# Altium project PCB_MainControlV20.PrjPCB
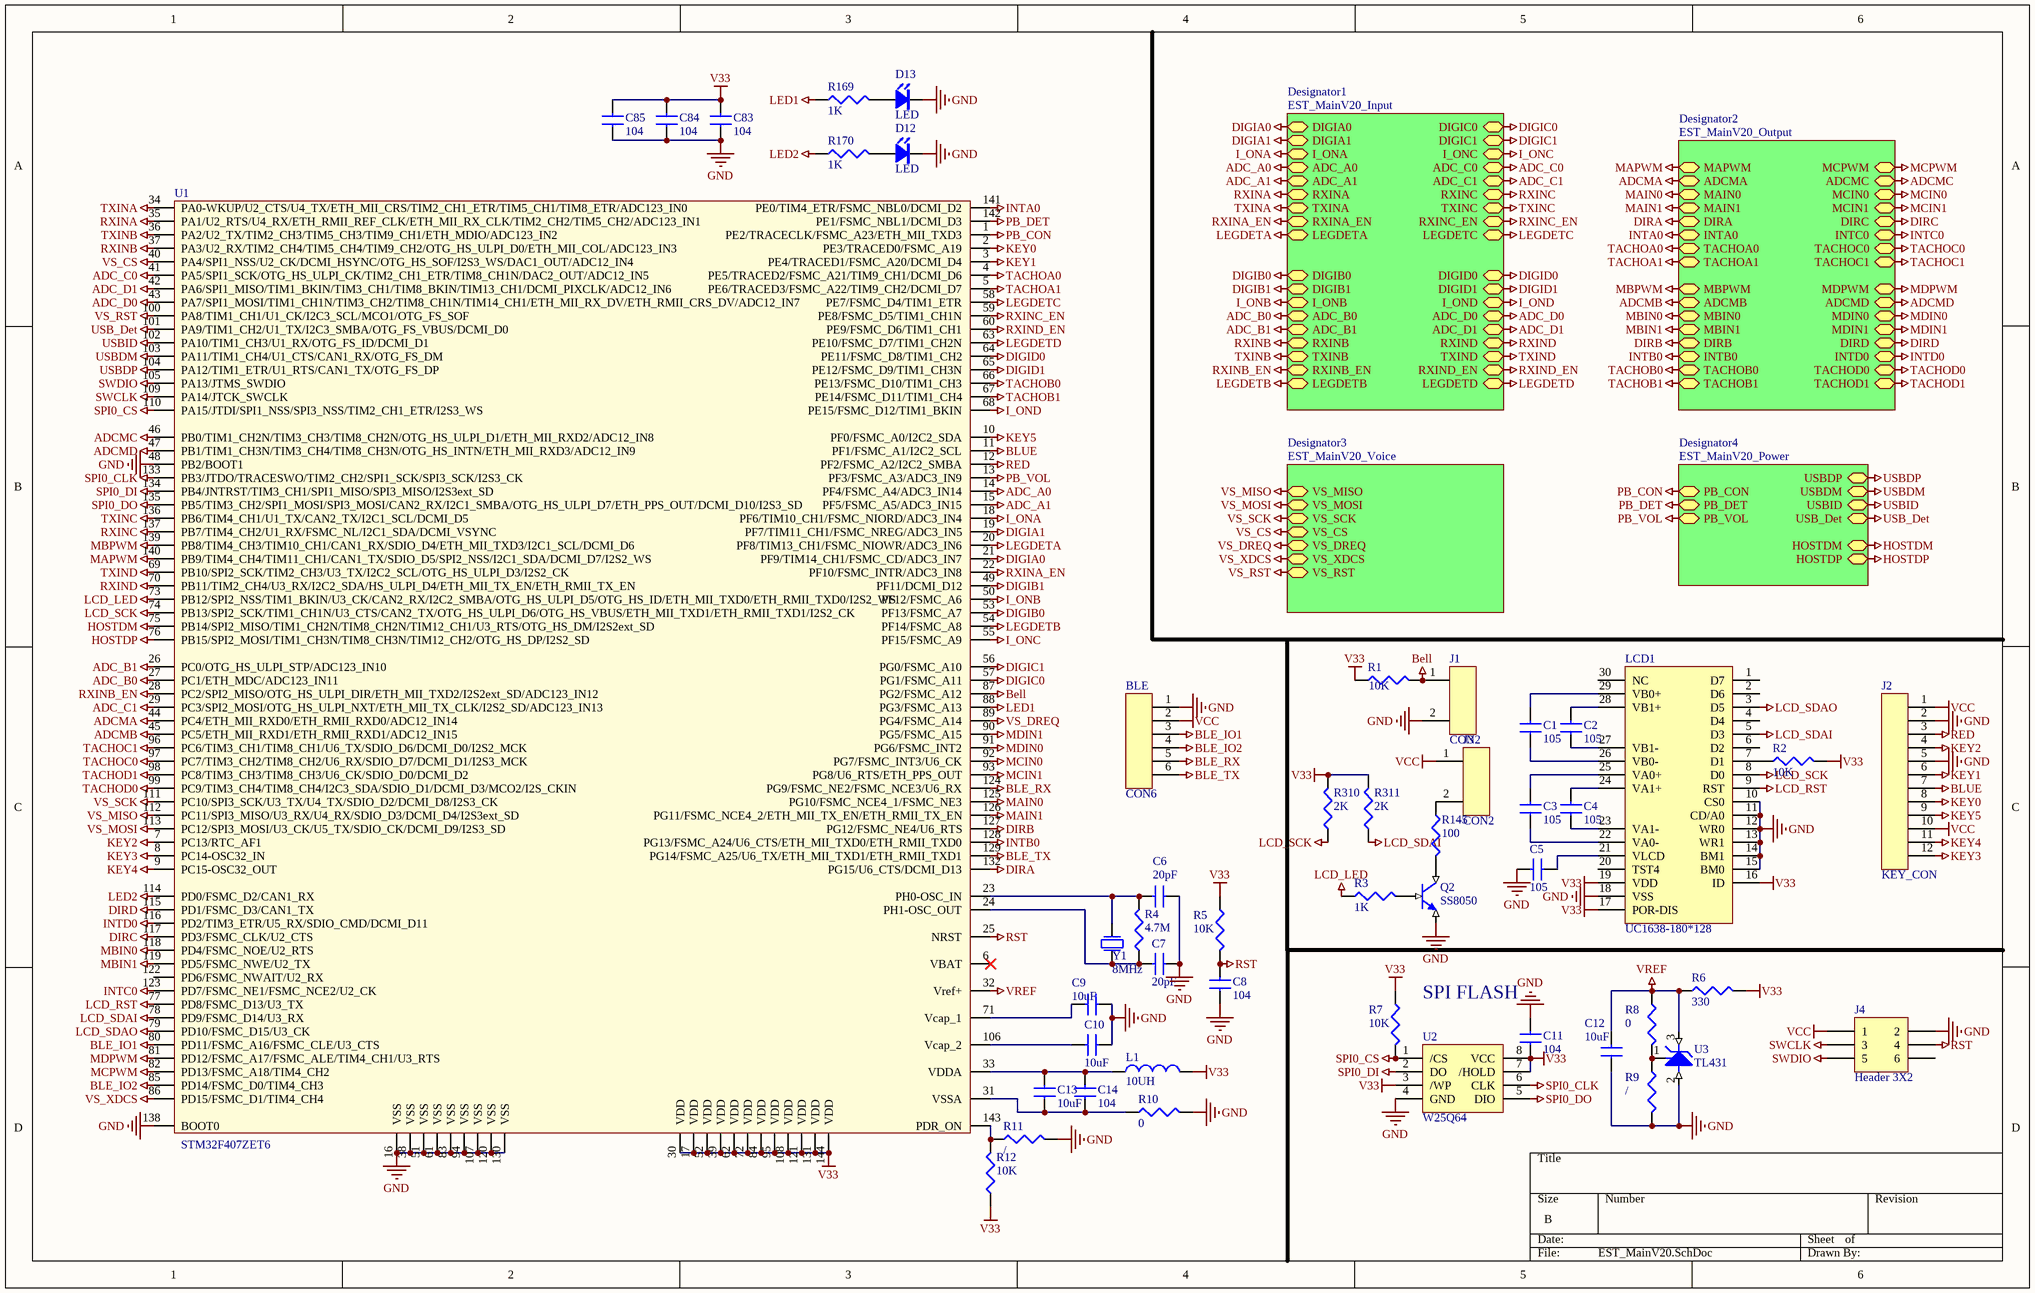
[diagram p0: EST_MainV20.SchDoc]
5 sheets, 330 parts. Net scope: hierarchical (ports join the sheet entries above them; power ports are global).
Board file: EST_MainV20.PcbDoc
Sheets:
  EST_MainV20.SchDoc
    Designator1 = EST_MainV20_Input.SchDoc
    Designator2 = EST_MainV20_Output.SchDoc
    Designator4 = EST_MainV20_Power.SchDoc
    Designator3 = EST_MainV20_Voice.SchDoc

## Sheet EST_MainV20.SchDoc
size B

### Parts
BLE  CON6  [H2_2.0mm_2*3]
C1  105  [CAP_0603]
C2  105  [CAP_0603]
C3  105  [CAP_0603]
C4  105  [CAP_0603]
C5  105  [CAP_0805]
C6  20pF  [CAP_0603]
C7  20pF  [CAP_0603]
C8  104  [CAP_0603]
C9  value 10uF  [CAP_0805]  (hidden comment: 20pF)
C10  value 10uF  [CAP_0805]  (hidden comment: 20pF)
C11  104  [CAP_0603]
C12  value 10uF  [CAP_0805]  (hidden comment: 20pF)
C13  value 10uF  [CAP_0805]  (hidden comment: 20pF)
C14  104  [CAP_0603]
C83  104  [CAP_0603]
C84  104  [CAP_0603]
C85  104  [CAP_0603]
D12  LED  [LED-0603]
D13  LED  [LED-0603]
J1  CON2  [EST_DZ_SW]
J2  KEY_CON  [FPC_12P]
J3  CON2  [SIP2]
J4  Header 3X2  [H2_2.0mm_2*3]
L1  10UH  [0805]
LCD1  UC1638-180*128  [FPC_30P]
Q2  SS8050  [8050SMD]
R1  10K  [RES_0603]
R2  10K  [RES_0603]
R3  1K  [RES_0603]
R4  4.7M  [RES_0603]
R5  10K  [RES_0603]
R6  330  [RES_0603]
R7  10K  [RES_0603]
R8  0  [RES_0603]
R9  /  [RES_0603]
R10  0  [RES_0603]
R11  /  [RES_0603]
R12  10K  [RES_0603]
R145  100  [1206]
R169  1K  [RES_0603]
R170  1K  [RES_0603]
R310  2K  [RES_0603]
R311  2K  [RES_0603]
U1  STM32F407ZET6  [LQFP144]
U2  W25Q64  [WSON8]
U3  TL431  [TL431(SOT23)]
Y1  8MHz  [XTAL_5032]

### Sub-sheets
Designator1 = EST_MainV20_Input: DIGIA0, DIGIA1, I_ONA, ADC_A0, ADC_A1, RXINA, TXINA, RXINA_EN, DIGIC0, DIGIC1, I_ONC, ADC_C0, ADC_C1, RXINC, TXINC, RXINC_EN, DIGIB0, DIGIB1, I_ONB, ADC_B0, ADC_B1, RXINB, TXINB, RXINB_EN, DIGID0, DIGID1, I_OND, ADC_D0, ADC_D1, RXIND, TXIND, RXIND_EN, LEGDETA, LEGDETC, LEGDETB, LEGDETD
Designator2 = EST_MainV20_Output: MAPWM, ADCMA, MAIN0, MAIN1, DIRA, INTA0, MBPWM, ADCMB, MBIN0, MBIN1, DIRB, INTB0, MCPWM, ADCMC, MCIN0, MCIN1, DIRC, INTC0, MDPWM, ADCMD, MDIN0, MDIN1, DIRD, INTD0, TACHOA0, TACHOA1, TACHOB0, TACHOB1, TACHOC0, TACHOC1, TACHOD0, TACHOD1
Designator3 = EST_MainV20_Voice: VS_MISO, VS_MOSI, VS_SCK, VS_CS, VS_DREQ, VS_XDCS, VS_RST
Designator4 = EST_MainV20_Power: PB_CON, PB_DET, PB_VOL, USBDP, USBDM, USBID, USB_Det, HOSTDM, HOSTDP

### Nets
ADC_A0: U1.14(PF4/FSMC_A4/ADC3_IN14) ; sheet Designator1/ADC_A0
ADC_A1: U1.15(PF5/FSMC_A5/ADC3_IN15) ; sheet Designator1/ADC_A1
ADC_B0: U1.27(PC1/ETH_MDC/ADC123_IN11) ; sheet Designator1/ADC_B0
ADC_B1: U1.26(PC0/OTG_HS_ULPI_STP/ADC123_IN10) ; sheet Designator1/ADC_B1
ADC_C0: U1.41(PA5/SPI1_SCK/OTG_HS_ULPI_CK/TIM2_CH1_ETR/TIM8_CH1N/DAC2_OUT/ADC12_IN5) ; sheet Designator1/ADC_C0
ADC_C1: U1.29(PC3/SPI2_MOSI/OTG_HS_ULPI_NXT/ETH_MII_TX_CLK/I2S2_SD/ADC123_IN13) ; sheet Designator1/ADC_C1
ADC_D0: U1.43(PA7/SPI1_MOSI/TIM1_CH1N/TIM3_CH2/TIM8_CH1N/TIM14_CH1/ETH_MII_RX_DV/ETH_RMII_CRS_DV/ADC12_IN7) ; sheet Designator1/ADC_D0
ADC_D1: U1.42(PA6/SPI1_MISO/TIM1_BKIN/TIM3_CH1/TIM8_BKIN/TIM13_CH1/DCMI_PIXCLK/ADC12_IN6) ; sheet Designator1/ADC_D1
ADCMA: U1.44(PC4/ETH_MII_RXD0/ETH_RMII_RXD0/ADC12_IN14) ; sheet Designator2/ADCMA
ADCMB: U1.45(PC5/ETH_MII_RXD1/ETH_RMII_RXD1/ADC12_IN15) ; sheet Designator2/ADCMB
ADCMC: U1.46(PB0/TIM1_CH2N/TIM3_CH3/TIM8_CH2N/OTG_HS_ULPI_D1/ETH_MII_RXD2/ADC12_IN8) ; sheet Designator2/ADCMC
ADCMD: U1.47(PB1/TIM1_CH3N/TIM3_CH4/TIM8_CH3N/OTG_HS_INTN/ETH_MII_RXD3/ADC12_IN9) ; sheet Designator2/ADCMD
Bell: J1.1 R1.1(TOP) U1.87(PG2/FSMC_A12)
BLE_IO1: BLE.3 U1.80(PD11/FSMC_A16/FSMC_CLE/U3_CTS)
BLE_IO2: BLE.4 U1.85(PD14/FSMC_D0/TIM4_CH3)
BLE_RX: BLE.5 U1.124(PG9/FSMC_NE2/FSMC_NCE3/U6_RX)
BLE_TX: BLE.6 U1.129(PG14/FSMC_A25/U6_TX/ETH_MII_TXD1/ETH_RMII_TXD1)
BLUE: J2.7 U1.11(PF1/FSMC_A1/I2C2_SCL)
DIGIA0: U1.21(PF9/TIM14_CH1/FSMC_CD/ADC3_IN7) ; sheet Designator1/DIGIA0
DIGIA1: U1.19(PF7/TIM11_CH1/FSMC_NREG/ADC3_IN5) ; sheet Designator1/DIGIA1
DIGIB0: U1.53(PF13/FSMC_A7) ; sheet Designator1/DIGIB0
DIGIB1: U1.49(PF11/DCMI_D12) ; sheet Designator1/DIGIB1
DIGIC0: U1.57(PG1/FSMC_A11) ; sheet Designator1/DIGIC0
DIGIC1: U1.56(PG0/FSMC_A10) ; sheet Designator1/DIGIC1
DIGID0: U1.64(PE11/FSMC_D8/TIM1_CH2) ; sheet Designator1/DIGID0
DIGID1: U1.65(PE12/FSMC_D9/TIM1_CH3N) ; sheet Designator1/DIGID1
DIRA: U1.132(PG15/U6_CTS/DCMI_D13) ; sheet Designator2/DIRA
DIRB: U1.127(PG12/FSMC_NE4/U6_RTS) ; sheet Designator2/DIRB
DIRC: U1.117(PD3/FSMC_CLK/U2_CTS) ; sheet Designator2/DIRC
DIRD: U1.115(PD1/FSMC_D3/CAN1_TX) ; sheet Designator2/DIRD
GND: BLE.1 C5.1 C6.1 C7.1 C8.1 C9.2 C10.1 C11.1 C12.1 C83.2 C84.2 C85.2 D12.2(K) D13.2(K) J1.2 J2.2 J2.5 J4.2 LCD1.10(CS0) LCD1.11(CD/A0) LCD1.12(WR0) LCD1.13(WR1) LCD1.14(BM1) LCD1.15(BM0) LCD1.18(VSS) Q2.1(E) R9.1(TOP) R10.1(TOP) R11.1(TOP) U1.16(VSS) U1.38(VSS) U1.48(PB2/BOOT1) U1.51(VSS) U1.61(VSS) U1.83(VSS) U1.94(VSS) U1.107(VSS) U1.120(VSS) U1.130(VSS) U1.138(BOOT0) U2.4(GND) U3.2(A)
HOSTDM: U1.75(PB14/SPI2_MISO/TIM1_CH2N/TIM8_CH2N/TIM12_CH1/U3_RTS/OTG_HS_DM/I2S2ext_SD) ; sheet Designator4/HOSTDM
HOSTDP: U1.76(PB15/SPI2_MOSI/TIM1_CH3N/TIM8_CH3N/TIM12_CH2/OTG_HS_DP/I2S2_SD) ; sheet Designator4/HOSTDP
I_ONA: U1.18(PF6/TIM10_CH1/FSMC_NIORD/ADC3_IN4) ; sheet Designator1/I_ONA
I_ONB: U1.50(PF12/FSMC_A6) ; sheet Designator1/I_ONB
I_ONC: U1.55(PF15/FSMC_A9) ; sheet Designator1/I_ONC
I_OND: U1.68(PE15/FSMC_D12/TIM1_BKIN) ; sheet Designator1/I_OND
INTA0: U1.141(PE0/TIM4_ETR/FSMC_NBL0/DCMI_D2) ; sheet Designator2/INTA0
INTB0: U1.128(PG13/FSMC_A24/U6_CTS/ETH_MII_TXD0/ETH_RMII_TXD0) ; sheet Designator2/INTB0
INTC0: U1.123(PD7/FSMC_NE1/FSMC_NCE2/U2_CK) ; sheet Designator2/INTC0
INTD0: U1.116(PD2/TIM3_ETR/U5_RX/SDIO_CMD/DCMI_D11) ; sheet Designator2/INTD0
KEY0: J2.8 U1.2(PE3/TRACED0/FSMC_A19)
KEY1: J2.6 U1.3(PE4/TRACED1/FSMC_A20/DCMI_D4)
KEY2: J2.4 U1.7(PC13/RTC_AF1)
KEY3: J2.12 U1.8(PC14-OSC32_IN)
KEY4: J2.11 U1.9(PC15-OSC32_OUT)
KEY5: J2.9 U1.10(PF0/FSMC_A0/I2C2_SDA)
LCD_LED: R3.2(BOT) U1.73(PB12/SPI2_NSS/TIM1_BKIN/U3_CK/CAN2_RX/I2C2_SMBA/OTG_HS_ULPI_D5/OTG_HS_ID/ETH_MII_TXD0/ETH_RMII_TXD0/I2S2_WS)
LCD_RST: LCD1.9(RST) U1.77(PD8/FSMC_D13/U3_TX)
LCD_SCK: LCD1.8(D0) R310.2(BOT) U1.74(PB13/SPI2_SCK/TIM1_CH1N/U3_CTS/CAN2_TX/OTG_HS_ULPI_D6/OTG_HS_VBUS/ETH_MII_TXD1/ETH_RMII_TXD1/I2S2_CK)
LCD_SDAI: LCD1.5(D3) R311.2(BOT) U1.78(PD9/FSMC_D14/U3_RX)
LCD_SDAO: LCD1.3(D5) U1.79(PD10/FSMC_D15/U3_CK)
LED1: R169.2(BOT) U1.88(PG3/FSMC_A13)
LED2: R170.2(BOT) U1.114(PD0/FSMC_D2/CAN1_RX)
LEGDETA: U1.20(PF8/TIM13_CH1/FSMC_NIOWR/ADC3_IN6) ; sheet Designator1/LEGDETA
LEGDETB: U1.54(PF14/FSMC_A8) ; sheet Designator1/LEGDETB
LEGDETC: U1.58(PE7/FSMC_D4/TIM1_ETR) ; sheet Designator1/LEGDETC
LEGDETD: U1.63(PE10/FSMC_D7/TIM1_CH2N) ; sheet Designator1/LEGDETD
MAIN0: U1.125(PG10/FSMC_NCE4_1/FSMC_NE3) ; sheet Designator2/MAIN0
MAIN1: U1.126(PG11/FSMC_NCE4_2/ETH_MII_TX_EN/ETH_RMII_TX_EN) ; sheet Designator2/MAIN1
MAPWM: U1.140(PB9/TIM4_CH4/TIM11_CH1/CAN1_TX/SDIO_D5/SPI2_NSS/I2C1_SDA/DCMI_D7/I2S2_WS) ; sheet Designator2/MAPWM
MBIN0: U1.118(PD4/FSMC_NOE/U2_RTS) ; sheet Designator2/MBIN0
MBIN1: U1.119(PD5/FSMC_NWE/U2_TX) ; sheet Designator2/MBIN1
MBPWM: U1.139(PB8/TIM4_CH3/TIM10_CH1/CAN1_RX/SDIO_D4/ETH_MII_TXD3/I2C1_SCL/DCMI_D6) ; sheet Designator2/MBPWM
MCIN0: U1.92(PG7/FSMC_INT3/U6_CK) ; sheet Designator2/MCIN0
MCIN1: U1.93(PG8/U6_RTS/ETH_PPS_OUT) ; sheet Designator2/MCIN1
MCPWM: U1.82(PD13/FSMC_A18/TIM4_CH2) ; sheet Designator2/MCPWM
MDIN0: U1.91(PG6/FSMC_INT2) ; sheet Designator2/MDIN0
MDIN1: U1.90(PG5/FSMC_A15) ; sheet Designator2/MDIN1
MDPWM: U1.81(PD12/FSMC_A17/FSMC_ALE/TIM4_CH1/U3_RTS) ; sheet Designator2/MDPWM
PB_CON: U1.1(PE2/TRACECLK/FSMC_A23/ETH_MII_TXD3) ; sheet Designator4/PB_CON
PB_DET: U1.142(PE1/FSMC_NBL1/DCMI_D3) ; sheet Designator4/PB_DET
PB_VOL: U1.13(PF3/FSMC_A3/ADC3_IN9) ; sheet Designator4/PB_VOL
RED: J2.3 U1.12(PF2/FSMC_A2/I2C2_SMBA)
RST: C8.2 J4.4 R5.1(TOP) U1.25(NRST)
RXINA: U1.35(PA1/U2_RTS/U4_RX/ETH_RMII_REF_CLK/ETH_MII_RX_CLK/TIM2_CH2/TIM5_CH2/ADC123_IN1) ; sheet Designator1/RXINA
RXINA_EN: U1.22(PF10/FSMC_INTR/ADC3_IN8) ; sheet Designator1/RXINA_EN
RXINB: U1.37(PA3/U2_RX/TIM2_CH4/TIM5_CH4/TIM9_CH2/OTG_HS_ULPI_D0/ETH_MII_COL/ADC123_IN3) ; sheet Designator1/RXINB
RXINB_EN: U1.28(PC2/SPI2_MISO/OTG_HS_ULPI_DIR/ETH_MII_TXD2/I2S2ext_SD/ADC123_IN12) ; sheet Designator1/RXINB_EN
RXINC: U1.137(PB7/TIM4_CH2/U1_RX/FSMC_NL/I2C1_SDA/DCMI_VSYNC) ; sheet Designator1/RXINC
RXINC_EN: U1.59(PE8/FSMC_D5/TIM1_CH1N) ; sheet Designator1/RXINC_EN
RXIND: U1.70(PB11/TIM2_CH4/U3_RX/I2C2_SDA/HS_ULPI_D4/ETH_MII_TX_EN/ETH_RMII_TX_EN) ; sheet Designator1/RXIND
RXIND_EN: U1.60(PE9/FSMC_D6/TIM1_CH1) ; sheet Designator1/RXIND_EN
SPI0_CLK: U1.133(PB3/JTDO/TRACESWO/TIM2_CH2/SPI1_SCK/SPI3_SCK/I2S3_CK) U2.6(CLK)
SPI0_CS: R7.1(TOP) U1.110(PA15/JTDI/SPI1_NSS/SPI3_NSS/TIM2_CH1_ETR/I2S3_WS) U2.1(/CS)
SPI0_DI: U1.134(PB4/JNTRST/TIM3_CH1/SPI1_MISO/SPI3_MISO/I2S3ext_SD) U2.2(DO)
SPI0_DO: U1.135(PB5/TIM3_CH2/SPI1_MOSI/SPI3_MOSI/CAN2_RX/I2C1_SMBA/OTG_HS_ULPI_D7/ETH_PPS_OUT/DCMI_D10/I2S3_SD) U2.5(DIO)
SWCLK: J4.3 U1.109(PA14/JTCK_SWCLK)
SWDIO: J4.5 U1.105(PA13/JTMS_SWDIO)
TACHOA0: U1.4(PE5/TRACED2/FSMC_A21/TIM9_CH1/DCMI_D6) ; sheet Designator2/TACHOA0
TACHOA1: U1.5(PE6/TRACED3/FSMC_A22/TIM9_CH2/DCMI_D7) ; sheet Designator2/TACHOA1
TACHOB0: U1.66(PE13/FSMC_D10/TIM1_CH3) ; sheet Designator2/TACHOB0
TACHOB1: U1.67(PE14/FSMC_D11/TIM1_CH4) ; sheet Designator2/TACHOB1
TACHOC0: U1.97(PC7/TIM3_CH2/TIM8_CH2/U6_RX/SDIO_D7/DCMI_D1/I2S3_MCK) ; sheet Designator2/TACHOC0
TACHOC1: U1.96(PC6/TIM3_CH1/TIM8_CH1/U6_TX/SDIO_D6/DCMI_D0/I2S2_MCK) ; sheet Designator2/TACHOC1
TACHOD0: U1.99(PC9/TIM3_CH4/TIM8_CH4/I2C3_SDA/SDIO_D1/DCMI_D3/MCO2/I2S_CKIN) ; sheet Designator2/TACHOD0
TACHOD1: U1.98(PC8/TIM3_CH3/TIM8_CH3/U6_CK/SDIO_D0/DCMI_D2) ; sheet Designator2/TACHOD1
TXINA: U1.34(PA0-WKUP/U2_CTS/U4_TX/ETH_MII_CRS/TIM2_CH1_ETR/TIM5_CH1/TIM8_ETR/ADC123_IN0) ; sheet Designator1/TXINA
TXINB: U1.36(PA2/U2_TX/TIM2_CH3/TIM5_CH3/TIM9_CH1/ETH_MDIO/ADC123_IN2) ; sheet Designator1/TXINB
TXINC: U1.136(PB6/TIM4_CH1/U1_TX/CAN2_TX/I2C1_SCL/DCMI_D5) ; sheet Designator1/TXINC
TXIND: U1.69(PB10/SPI2_SCK/TIM2_CH3/U3_TX/I2C2_SCL/OTG_HS_ULPI_D3/I2S2_CK) ; sheet Designator1/TXIND
USB_Det: U1.101(PA9/TIM1_CH2/U1_TX/I2C3_SMBA/OTG_FS_VBUS/DCMI_D0) ; sheet Designator4/USB_Det
USBDM: U1.103(PA11/TIM1_CH4/U1_CTS/CAN1_RX/OTG_FS_DM) ; sheet Designator4/USBDM
USBDP: U1.104(PA12/TIM1_ETR/U1_RTS/CAN1_TX/OTG_FS_DP) ; sheet Designator4/USBDP
USBID: U1.102(PA10/TIM1_CH3/U1_RX/OTG_FS_ID/DCMI_D1) ; sheet Designator4/USBID
V33: BLE.2 C11.2 C83.1 C84.1 C85.1 J2.1 J2.10 J3.1 J4.1 L1.2 LCD1.16(ID) LCD1.17(POR-DIS) LCD1.19(VDD) R1.2(BOT) R2.1(TOP) R5.2(BOT) R6.1(TOP) R7.2(BOT) R12.2(BOT) R310.1(TOP) R311.1(TOP) U1.17(VDD) U1.30(VDD) U1.39(VDD) U1.52(VDD) U1.62(VDD) U1.72(VDD) U1.84(VDD) U1.95(VDD) U1.108(VDD) U1.121(VDD) U1.131(VDD) U1.144(VDD) U2.3(/WP) U2.7(/HOLD) U2.8(VCC)  [also labelled VCC]
VREF: C12.2 R6.2(BOT) R8.2(BOT) U1.32(Vref+) U3.3(K)
VS_CS: U1.40(PA4/SPI1_NSS/U2_CK/DCMI_HSYNC/OTG_HS_SOF/I2S3_WS/DAC1_OUT/ADC12_IN4) ; sheet Designator3/VS_CS
VS_DREQ: U1.89(PG4/FSMC_A14) ; sheet Designator3/VS_DREQ
VS_MISO: U1.112(PC11/SPI3_MISO/U3_RX/U4_RX/SDIO_D3/DCMI_D4/I2S3ext_SD) ; sheet Designator3/VS_MISO
VS_MOSI: U1.113(PC12/SPI3_MOSI/U3_CK/U5_TX/SDIO_CK/DCMI_D9/I2S3_SD) ; sheet Designator3/VS_MOSI
VS_RST: U1.100(PA8/TIM1_CH1/U1_CK/I2C3_SCL/MCO1/OTG_FS_SOF) ; sheet Designator3/VS_RST
VS_SCK: U1.111(PC10/SPI3_SCK/U3_TX/U4_TX/SDIO_D2/DCMI_D8/I2S3_CK) ; sheet Designator3/VS_SCK
VS_XDCS: U1.86(PD15/FSMC_D1/TIM4_CH4) ; sheet Designator3/VS_XDCS
NetC1_1: C1.1 LCD1.29(VB0+)
NetC1_2: C1.2 LCD1.26(VB0-)
NetC2_1: C2.1 LCD1.28(VB1+)
NetC2_2: C2.2 LCD1.27(VB1-)
NetC3_1: C3.1 LCD1.25(VA0+)
NetC3_2: C3.2 LCD1.22(VA0-)
NetC4_1: C4.1 LCD1.24(VA1+)
NetC4_2: C4.2 LCD1.23(VA1-)
NetC5_2: C5.2 LCD1.21(VLCD)
NetC6_2: C6.2 R4.2(BOT) U1.23(PH0-OSC_IN) Y1.1(P1)
NetC7_2: C7.2 R4.1(TOP) U1.24(PH1-OSC_OUT) Y1.2(P2)
NetC9_1: C9.1 U1.71(Vcap_1)
NetC10_2: C10.2 U1.106(Vcap_2)
NetC13_1: C13.1 C14.2 R10.2(BOT) U1.31(VSSA)
NetC13_2: C13.2 C14.1 L1.1 U1.33(VDDA)
NetD12_1: D12.1(A) R170.1(TOP)
NetD13_1: D13.1(A) R169.1(TOP)
NetJ3_2: J3.2 R145.2(BOT)
NetLCD1_7: LCD1.7(D1) R2.2(BOT)
NetQ2_2: Q2.2(B) R3.1(TOP)
NetQ2_3: Q2.3(C) R145.1(TOP)
NetR8_1: R8.1(TOP) R9.2(BOT) U3.1(R)
NetR11_2: R11.2(BOT) R12.1(TOP) U1.143(PDR_ON)

Not connected (* = marked no-connect by the designer): J4 6; LCD1 1(D7) 2(D6) 4(D4) 6(D2) 20(TST4) 30(NC); U1 6(VBAT)* 122(PD6/FSMC_NWAIT/U2_RX)

### Notes on the sheet
- SPI FLASH

### Library data of the parts
C1-C14 C83-C85 = CAP: Capacitor
  C6 C7: Value: 20pF
J1 J3 = CON2: SOCKET
J2 = CON12: SOCKET
J4 = Header 3X2: Header, 3-Pin, Dual row; LatestRevisionDate: 17-Jul-2002; LatestRevisionNote: Re-released for DXP Platform.; Publisher: Altium Limited
L1 = INDUCTOR
LCD1 = UC1638
Q2 = NPN: triode
R1-R12 R145 R169 R170 R310 R311 = RES: Resistor
U2 = 25P16
U3 = TL431: Adjustable Precision Shunt Regulator
Y1 = XTAL: CRYSTAL

## Sheet EST_MainV20_Input.SchDoc
size B
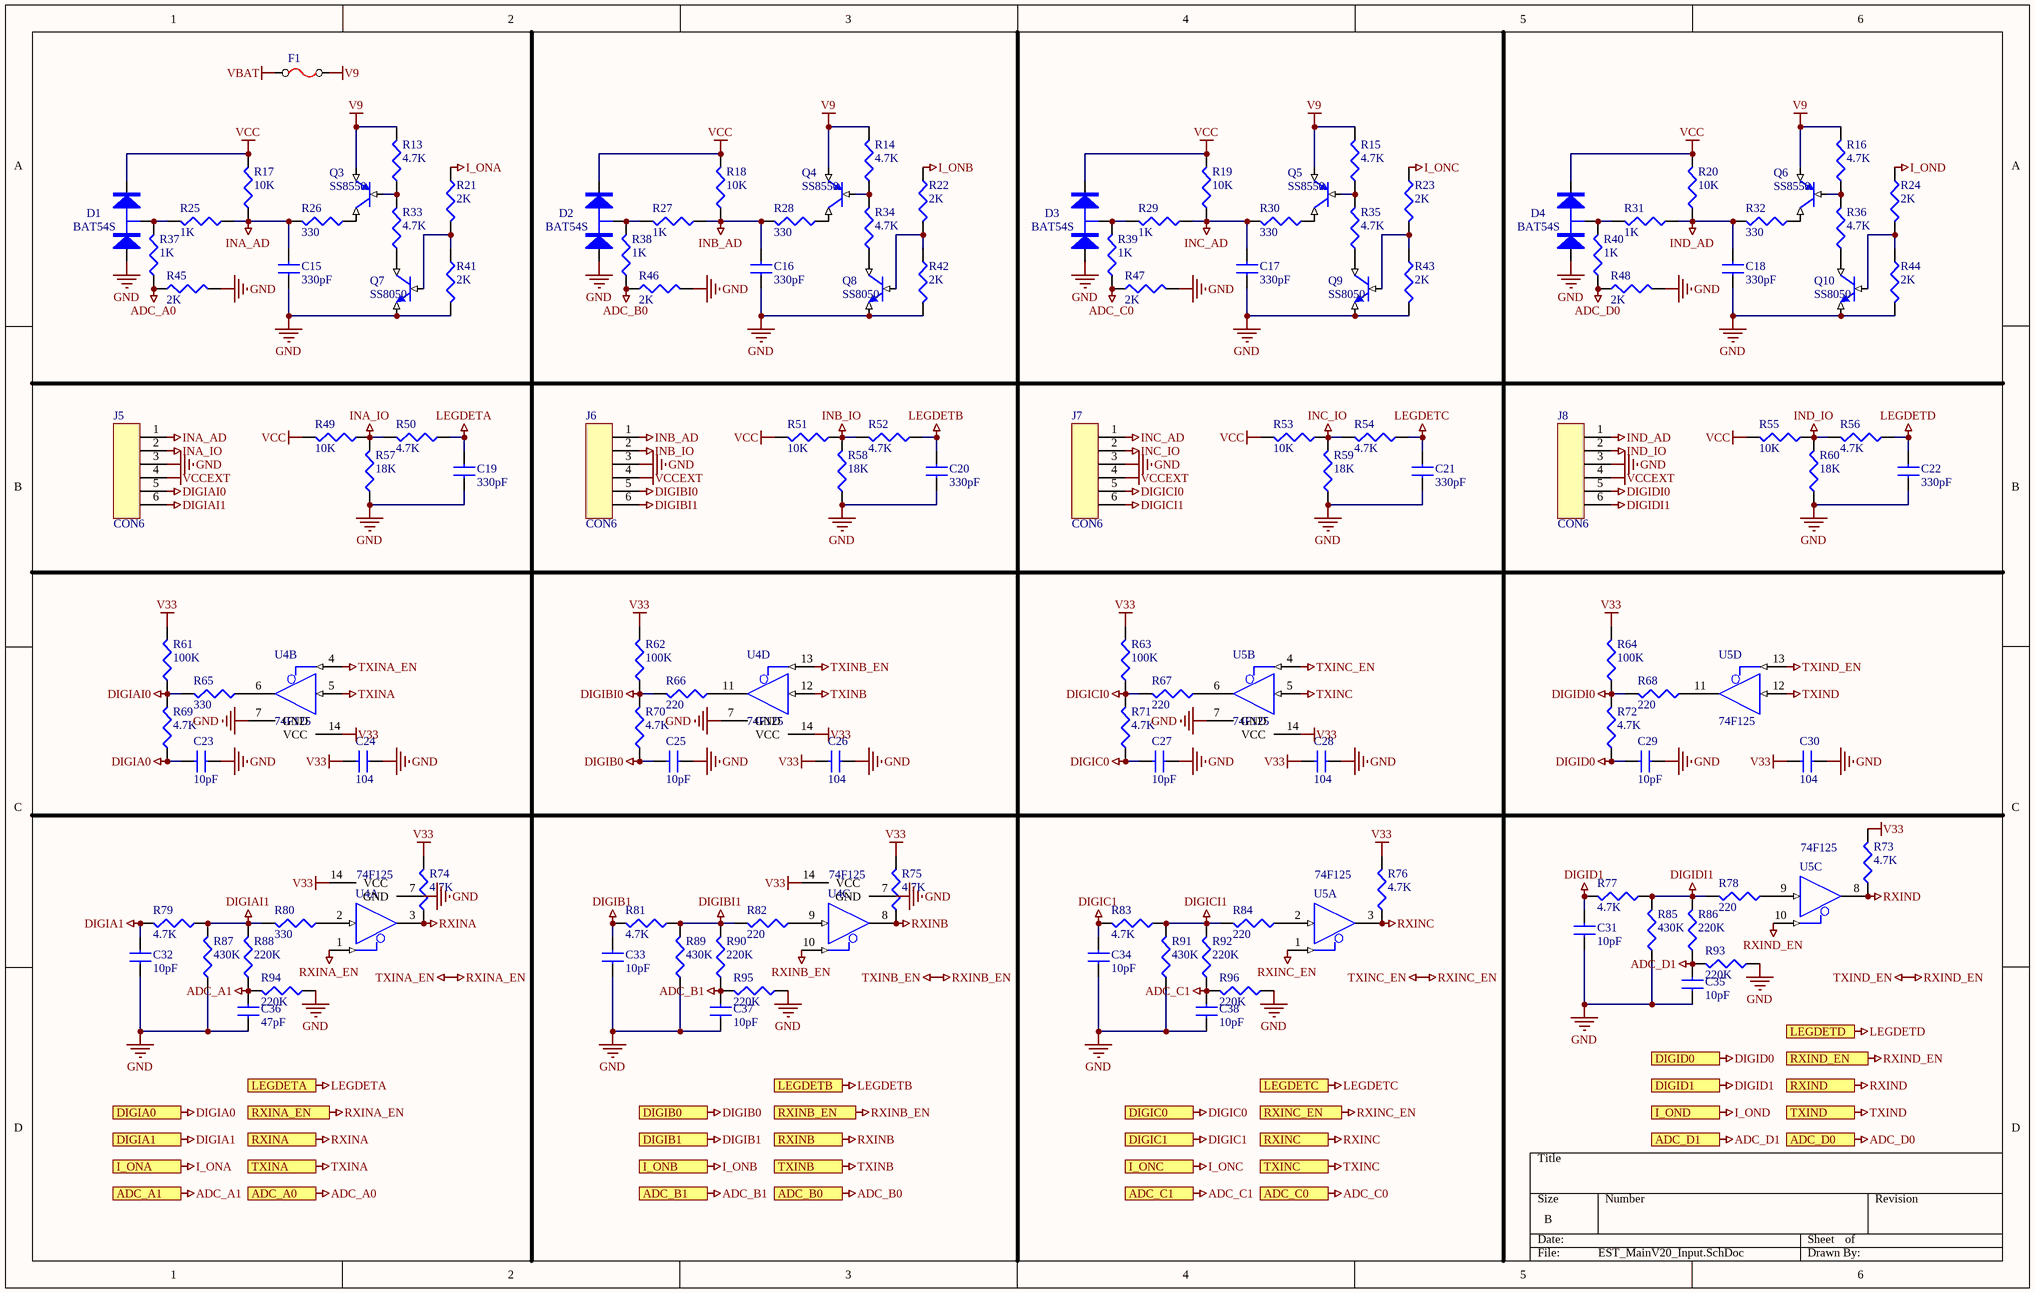
[diagram p1: EST_MainV20_Input.SchDoc]

### Parts
C15  330pF  [CAP_0603]
C16  330pF  [CAP_0603]
C17  330pF  [CAP_0603]
C18  330pF  [CAP_0603]
C19  330pF  [CAP_0603]
C20  330pF  [CAP_0603]
C21  330pF  [CAP_0603]
C22  330pF  [CAP_0603]
C23  10pF  [CAP_0603]
C24  104  [CAP_0603]
C25  10pF  [CAP_0603]
C26  104  [CAP_0603]
C27  10pF  [CAP_0603]
C28  104  [CAP_0603]
C29  10pF  [CAP_0603]
C30  104  [CAP_0603]
C31  10pF  [CAP_0603]
C32  10pF  [CAP_0603]
C33  10pF  [CAP_0603]
C34  10pF  [CAP_0603]
C35  10pF  [CAP_0603]
C36  47pF  [CAP_0603]
C37  10pF  [CAP_0603]
C38  10pF  [CAP_0603]
D1  BAT54S  [BAT54S]
D2  BAT54S  [BAT54S]
D3  BAT54S  [BAT54S]
D4  BAT54S  [BAT54S]
F1  FUSE  [1812]  (value not drawn)
J5  CON6  [Lego_RJ11]
J6  CON6  [Lego_RJ11]
J7  CON6  [Lego_RJ11]
J8  CON6  [Lego_RJ11]
Q3  SS8550  [8050SMD]
Q4  SS8550  [8050SMD]
Q5  SS8550  [8050SMD]
Q6  SS8550  [8050SMD]
Q7  SS8050  [8050SMD]
Q8  SS8050  [8050SMD]
Q9  SS8050  [8050SMD]
Q10  SS8050  [8050SMD]
R13  4.7K  [RES_0603]
R14  4.7K  [RES_0603]
R15  4.7K  [RES_0603]
R16  4.7K  [RES_0603]
R17  10K  [RES_0603]
R18  10K  [RES_0603]
R19  10K  [RES_0603]
R20  10K  [RES_0603]
R21  2K  [RES_0603]
R22  2K  [RES_0603]
R23  2K  [RES_0603]
R24  2K  [RES_0603]
R25  1K  [RES_0603]
R26  330  [RES_0603]
R27  1K  [RES_0603]
R28  330  [RES_0603]
R29  1K  [RES_0603]
R30  330  [RES_0603]
R31  1K  [RES_0603]
R32  330  [RES_0603]
R33  4.7K  [RES_0603]
R34  4.7K  [RES_0603]
R35  4.7K  [RES_0603]
R36  4.7K  [RES_0603]
R37  1K  [RES_0603]
R38  1K  [RES_0603]
R39  1K  [RES_0603]
R40  1K  [RES_0603]
R41  2K  [RES_0603]
R42  2K  [RES_0603]
R43  2K  [RES_0603]
R44  2K  [RES_0603]
R45  2K  [RES_0603]
R46  2K  [RES_0603]
R47  2K  [RES_0603]
R48  2K  [RES_0603]
R49  10K  [RES_0603]
R50  4.7K  [RES_0603]
R51  10K  [RES_0603]
R52  4.7K  [RES_0603]
R53  10K  [RES_0603]
R54  4.7K  [RES_0603]
R55  10K  [RES_0603]
R56  4.7K  [RES_0603]
R57  18K  [RES_0603]
R58  18K  [RES_0603]
R59  18K  [RES_0603]
R60  18K  [RES_0603]
R61  100K  [RES_0603]
R62  100K  [RES_0603]
R63  100K  [RES_0603]
R64  100K  [RES_0603]
R65  330  [RES_0603]
R66  220  [RES_0603]
R67  220  [RES_0603]
R68  220  [RES_0603]
R69  4.7K  [RES_0603]
R70  4.7K  [RES_0603]
R71  4.7K  [RES_0603]
R72  4.7K  [RES_0603]
R73  4.7K  [RES_0603]
R74  4.7K  [RES_0603]
R75  4.7K  [RES_0603]
R76  4.7K  [RES_0603]
R77  4.7K  [RES_0603]
R78  220  [RES_0603]
R79  4.7K  [RES_0603]
R80  330  [RES_0603]
R81  4.7K  [RES_0603]
R82  220  [RES_0603]
R83  4.7K  [RES_0603]
R84  220  [RES_0603]
R85  430K  [RES_0603]
R86  220K  [RES_0603]
R87  430K  [RES_0603]
R88  220K  [RES_0603]
R89  430K  [RES_0603]
R90  220K  [RES_0603]
R91  430K  [RES_0603]
R92  220K  [RES_0603]
R93  220K  [RES_0603]
R94  220K  [RES_0603]
R95  220K  [RES_0603]
R96  220K  [RES_0603]
U4  74F125  [TSSOP14]  (parts A,B,C,D of 4)
U5  74F125  [TSSOP14]  (parts A,B,C,D of 4)

### Ports
ADC_A0, ADC_A1, ADC_B0, ADC_B1, ADC_C0, ADC_C1, ADC_D0, ADC_D1, DIGIA0, DIGIA1, DIGIB0, DIGIB1, DIGIC0, DIGIC1, DIGID0, DIGID1, I_ONA, I_ONB, I_ONC, I_OND, LEGDETA, LEGDETB, LEGDETC, LEGDETD, RXINA, RXINA_EN, RXINB, RXINB_EN, RXINC, RXINC_EN, RXIND, RXIND_EN, TXINA, TXINB, TXINC, TXIND

### Nets
ADC_A0: R37.2(BOT) R45.2(BOT) ; port ADC_A0
ADC_A1: C36.2 R88.2(BOT) R94.1(TOP) ; port ADC_A1
ADC_B0: R38.2(BOT) R46.2(BOT) ; port ADC_B0
ADC_B1: C37.2 R90.2(BOT) R95.1(TOP) ; port ADC_B1
ADC_C0: R39.2(BOT) R47.2(BOT) ; port ADC_C0
ADC_C1: C38.2 R92.2(BOT) R96.1(TOP) ; port ADC_C1
ADC_D0: R40.2(BOT) R48.2(BOT) ; port ADC_D0
ADC_D1: C35.2 R86.2(BOT) R93.1(TOP) ; port ADC_D1
DIGIA0: C23.1 R69.2(BOT) ; port DIGIA0
DIGIA1: C32.2 R79.1(TOP) ; port DIGIA1
DIGIAI0: J5.5 R61.2(BOT) R65.1(TOP) R69.1(TOP)
DIGIAI1: J5.6 R79.2(BOT) R80.1(TOP) R87.1(TOP) R88.1(TOP)
DIGIB0: C25.1 R70.2(BOT) ; port DIGIB0
DIGIB1: C33.2 R81.1(TOP) ; port DIGIB1
DIGIBI0: J6.5 R62.2(BOT) R66.1(TOP) R70.1(TOP)
DIGIBI1: J6.6 R81.2(BOT) R82.1(TOP) R89.1(TOP) R90.1(TOP)
DIGIC0: C27.1 R71.2(BOT) ; port DIGIC0
DIGIC1: C34.2 R83.1(TOP) ; port DIGIC1
DIGICI0: J7.5 R63.2(BOT) R67.1(TOP) R71.1(TOP)
DIGICI1: J7.6 R83.2(BOT) R84.1(TOP) R91.1(TOP) R92.1(TOP)
DIGID0: C29.1 R72.2(BOT) ; port DIGID0
DIGID1: C31.2 R77.1(TOP) ; port DIGID1
DIGIDI0: J8.5 R64.2(BOT) R68.1(TOP) R72.1(TOP)
DIGIDI1: J8.6 R77.2(BOT) R78.1(TOP) R85.1(TOP) R86.1(TOP)
GND: C15.2 C16.2 C17.2 C18.2 C19.2 C20.2 C21.2 C22.2 C23.2 C24.2 C25.2 C26.2 C27.2 C28.2 C29.2 C30.2 C31.1 C32.1 C33.1 C34.1 C35.1 C36.1 C37.1 C38.1 D1.1(A) D2.1(A) D3.1(A) D4.1(A) J5.3 J6.3 J7.3 J8.3 Q7.1(E) Q8.1(E) Q9.1(E) Q10.1(E) R41.1(TOP) R42.1(TOP) R43.1(TOP) R44.1(TOP) R45.1(TOP) R46.1(TOP) R47.1(TOP) R48.1(TOP) R57.2(BOT) R58.2(BOT) R59.2(BOT) R60.2(BOT) R85.2(BOT) R87.2(BOT) R89.2(BOT) R91.2(BOT) R93.2(BOT) R94.2(BOT) R95.2(BOT) R96.2(BOT) U4.7(GND) U5.7(GND)
I_ONA: R21.2(BOT) ; port I_ONA
I_ONB: R22.2(BOT) ; port I_ONB
I_ONC: R23.2(BOT) ; port I_ONC
I_OND: R24.2(BOT) ; port I_OND
INA_AD: C15.1 J5.1 R17.2(BOT) R25.2(BOT) R26.1(TOP)
INA_IO: J5.2 R49.2(BOT) R50.1(TOP) R57.1(TOP)
INB_AD: C16.1 J6.1 R18.2(BOT) R27.2(BOT) R28.1(TOP)
INB_IO: J6.2 R51.2(BOT) R52.1(TOP) R58.1(TOP)
INC_AD: C17.1 J7.1 R19.2(BOT) R29.2(BOT) R30.1(TOP)
INC_IO: J7.2 R53.2(BOT) R54.1(TOP) R59.1(TOP)
IND_AD: C18.1 J8.1 R20.2(BOT) R31.2(BOT) R32.1(TOP)
IND_IO: J8.2 R55.2(BOT) R56.1(TOP) R60.1(TOP)
LEGDETA: C19.1 R50.2(BOT) ; port LEGDETA
LEGDETB: C20.1 R52.2(BOT) ; port LEGDETB
LEGDETC: C21.1 R54.2(BOT) ; port LEGDETC
LEGDETD: C22.1 R56.2(BOT) ; port LEGDETD
RXINA: R74.2(BOT) U4.3(Y) ; port RXINA
RXINA_EN: U4.1(~{G}) U4.4(~{G}) ; port RXINA_EN  [also labelled TXINA_EN]
RXINB: R75.2(BOT) U4.8(Y) ; port RXINB
RXINB_EN: U4.10(~{G}) U4.13(~{G}) ; port RXINB_EN  [also labelled TXINB_EN]
RXINC: R76.2(BOT) U5.3(Y) ; port RXINC
RXINC_EN: U5.1(~{G}) U5.4(~{G}) ; port RXINC_EN  [also labelled TXINC_EN]
RXIND: R73.2(BOT) U5.8(Y) ; port RXIND
RXIND_EN: U5.10(~{G}) U5.13(~{G}) ; port RXIND_EN  [also labelled TXIND_EN]
TXINA: U4.5(A) ; port TXINA
TXINB: U4.12(A) ; port TXINB
TXINC: U5.5(A) ; port TXINC
TXIND: U5.12(A) ; port TXIND
V9: F1.2 Q3.1(E) Q4.1(E) Q5.1(E) Q6.1(E) R13.1(TOP) R14.1(TOP) R15.1(TOP) R16.1(TOP)
V33: C24.1 C26.1 C28.1 C30.1 D1.3(K) D2.3(K) D3.3(K) D4.3(K) R17.1(TOP) R18.1(TOP) R19.1(TOP) R20.1(TOP) R49.1(TOP) R51.1(TOP) R53.1(TOP) R55.1(TOP) R61.1(TOP) R62.1(TOP) R63.1(TOP) R64.1(TOP) R73.1(TOP) R74.1(TOP) R75.1(TOP) R76.1(TOP) U4.14(VCC) U5.14(VCC)  [also labelled VCC]
VBAT: F1.1
VCCEXT: J5.4 J6.4 J7.4 J8.4
NetD1_2: D1.2(C) R25.1(TOP) R37.1(TOP)
NetD2_2: D2.2(C) R27.1(TOP) R38.1(TOP)
NetD3_2: D3.2(C) R29.1(TOP) R39.1(TOP)
NetD4_2: D4.2(C) R31.1(TOP) R40.1(TOP)
NetQ3_2: Q3.2(B) R13.2(BOT) R33.1(TOP)
NetQ3_3: Q3.3(C) R26.2(BOT)
NetQ4_2: Q4.2(B) R14.2(BOT) R34.1(TOP)
NetQ4_3: Q4.3(C) R28.2(BOT)
NetQ5_2: Q5.2(B) R15.2(BOT) R35.1(TOP)
NetQ5_3: Q5.3(C) R30.2(BOT)
NetQ6_2: Q6.2(B) R16.2(BOT) R36.1(TOP)
NetQ6_3: Q6.3(C) R32.2(BOT)
NetQ7_2: Q7.2(B) R21.1(TOP) R41.2(BOT)
NetQ7_3: Q7.3(C) R33.2(BOT)
NetQ8_2: Q8.2(B) R22.1(TOP) R42.2(BOT)
NetQ8_3: Q8.3(C) R34.2(BOT)
NetQ9_2: Q9.2(B) R23.1(TOP) R43.2(BOT)
NetQ9_3: Q9.3(C) R35.2(BOT)
NetQ10_2: Q10.2(B) R24.1(TOP) R44.2(BOT)
NetQ10_3: Q10.3(C) R36.2(BOT)
NetR65_2: R65.2(BOT) U4.6(Y)
NetR66_2: R66.2(BOT) U4.11(Y)
NetR67_2: R67.2(BOT) U5.6(Y)
NetR68_2: R68.2(BOT) U5.11(Y)
NetR78_2: R78.2(BOT) U5.9(A)
NetR80_2: R80.2(BOT) U4.2(A)
NetR82_2: R82.2(BOT) U4.9(A)
NetR84_2: R84.2(BOT) U5.2(A)

### Library data of the parts
C15-C38 = CAP: Capacitor
D1-D4 = BANQIAO-A: DIODE BRIDGE
Q3-Q6 = PNP: triode
Q7-Q10 = NPN: triode
R13-R96 = RES: Resistor
U4 U5 = 74F125: Quad Bus Buffer Gate with 3-State Output

## Sheet EST_MainV20_Output.SchDoc
size A4
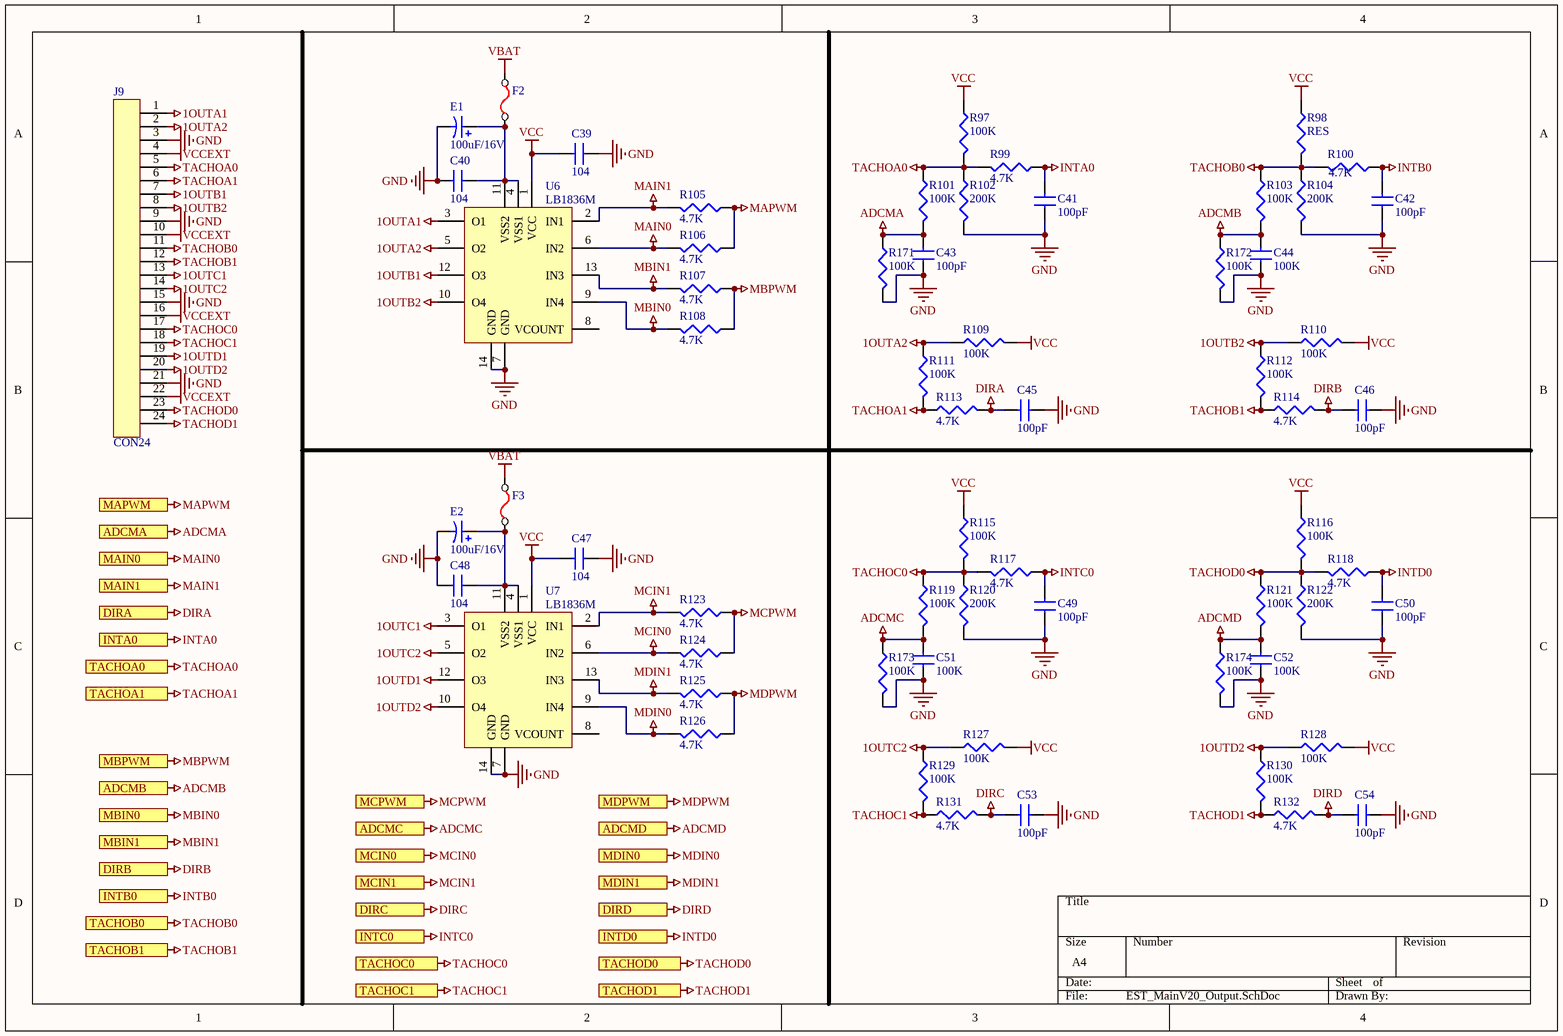
[diagram p2: EST_MainV20_Output.SchDoc]

### Parts
C39  104  [CAP_0603]
C40  104  [CAP_0603]
C41  100pF  [CAP_0603]
C42  100pF  [CAP_0603]
C43  100pF  [CAP_0603]
C44  100K  [CAP_0603]
C45  100pF  [CAP_0603]
C46  100pF  [CAP_0603]
C47  104  [CAP_0603]
C48  104  [CAP_0603]
C49  100pF  [CAP_0603]
C50  100pF  [CAP_0603]
C51  100K  [CAP_0603]
C52  100K  [CAP_0603]
C53  100pF  [CAP_0603]
C54  100pF  [CAP_0603]
E1  100uF/16V  [1812]
E2  100uF/16V  [1812]
F2  FUSE  [1812]  (value not drawn)
F3  FUSE  [1812]  (value not drawn)
J9  CON24  [RJ11-4]
R97  100K  [RES_0603]
R98  RES  [RES_0603]
R99  4.7K  [RES_0603]
R100  4.7K  [RES_0603]
R101  100K  [RES_0603]
R102  200K  [RES_0603]
R103  100K  [RES_0603]
R104  200K  [RES_0603]
R105  4.7K  [RES_0603]
R106  4.7K  [RES_0603]
R107  4.7K  [RES_0603]
R108  4.7K  [RES_0603]
R109  100K  [RES_0603]
R110  100K  [RES_0603]
R111  100K  [RES_0603]
R112  100K  [RES_0603]
R113  4.7K  [RES_0603]
R114  4.7K  [RES_0603]
R115  100K  [RES_0603]
R116  100K  [RES_0603]
R117  4.7K  [RES_0603]
R118  4.7K  [RES_0603]
R119  100K  [RES_0603]
R120  200K  [RES_0603]
R121  100K  [RES_0603]
R122  200K  [RES_0603]
R123  4.7K  [RES_0603]
R124  4.7K  [RES_0603]
R125  4.7K  [RES_0603]
R126  4.7K  [RES_0603]
R127  100K  [RES_0603]
R128  100K  [RES_0603]
R129  100K  [RES_0603]
R130  100K  [RES_0603]
R131  4.7K  [RES_0603]
R132  4.7K  [RES_0603]
R171  100K  [RES_0603]
R172  100K  [RES_0603]
R173  100K  [RES_0603]
R174  100K  [RES_0603]
U6  LB1836M  [LB1836]
U7  LB1836M  [LB1836]

### Ports
ADCMA, ADCMB, ADCMC, ADCMD, DIRA, DIRB, DIRC, DIRD, INTA0, INTB0, INTC0, INTD0, MAIN0, MAIN1, MAPWM, MBIN0, MBIN1, MBPWM, MCIN0, MCIN1, MCPWM, MDIN0, MDIN1, MDPWM, TACHOA0, TACHOA1, TACHOB0, TACHOB1, TACHOC0, TACHOC1, TACHOD0, TACHOD1

### Nets
1OUTA1: J9.1 U6.3(O1)
1OUTA2: J9.2 R109.2(BOT) R111.2(BOT) U6.5(O2)
1OUTB1: J9.7 U6.12(O3)
1OUTB2: J9.8 R110.2(BOT) R112.2(BOT) U6.10(O4)
1OUTC1: J9.13 U7.3(O1)
1OUTC2: J9.14 R127.2(BOT) R129.2(BOT) U7.5(O2)
1OUTD1: J9.19 U7.12(O3)
1OUTD2: J9.20 R128.2(BOT) R130.2(BOT) U7.10(O4)
ADCMA: C43.2 R101.1(TOP) R171.2(BOT) ; port ADCMA
ADCMB: C44.2 R103.1(TOP) R172.2(BOT) ; port ADCMB
ADCMC: C51.2 R119.1(TOP) R173.2(BOT) ; port ADCMC
ADCMD: C52.2 R121.1(TOP) R174.2(BOT) ; port ADCMD
DIRA: C45.2 R113.1(TOP) ; port DIRA
DIRB: C46.2 R114.1(TOP) ; port DIRB
DIRC: C53.2 R131.1(TOP) ; port DIRC
DIRD: C54.2 R132.1(TOP) ; port DIRD
GND: C39.2 C40.1 C41.1 C42.1 C43.1 C44.1 C45.1 C46.1 C47.2 C48.1 C49.1 C50.1 C51.1 C52.1 C53.1 C54.1 E1.2 E2.2 J9.3 J9.9 J9.15 J9.21 R102.1(TOP) R104.1(TOP) R120.1(TOP) R122.1(TOP) R171.1(TOP) R172.1(TOP) R173.1(TOP) R174.1(TOP) U6.7(GND) U6.14(GND) U7.7(GND) U7.14(GND)
INTA0: C41.2 R99.2(BOT) ; port INTA0
INTB0: C42.2 R100.2(BOT) ; port INTB0
INTC0: C49.2 R117.2(BOT) ; port INTC0
INTD0: C50.2 R118.2(BOT) ; port INTD0
MAIN0: R106.1(TOP) U6.6(IN2) ; port MAIN0
MAIN1: R105.1(TOP) U6.2(IN1) ; port MAIN1
MAPWM: R105.2(BOT) R106.2(BOT) ; port MAPWM
MBIN0: R108.1(TOP) U6.9(IN4) ; port MBIN0
MBIN1: R107.1(TOP) U6.13(IN3) ; port MBIN1
MBPWM: R107.2(BOT) R108.2(BOT) ; port MBPWM
MCIN0: R124.1(TOP) U7.6(IN2) ; port MCIN0
MCIN1: R123.1(TOP) U7.2(IN1) ; port MCIN1
MCPWM: R123.2(BOT) R124.2(BOT) ; port MCPWM
MDIN0: R126.1(TOP) U7.9(IN4) ; port MDIN0
MDIN1: R125.1(TOP) U7.13(IN3) ; port MDIN1
MDPWM: R125.2(BOT) R126.2(BOT) ; port MDPWM
TACHOA0: J9.5 R97.1(TOP) R99.1(TOP) R101.2(BOT) R102.2(BOT) ; port TACHOA0
TACHOA1: J9.6 R111.1(TOP) R113.2(BOT) ; port TACHOA1
TACHOB0: J9.11 R98.1(TOP) R100.1(TOP) R103.2(BOT) R104.2(BOT) ; port TACHOB0
TACHOB1: J9.12 R112.1(TOP) R114.2(BOT) ; port TACHOB1
TACHOC0: J9.17 R115.1(TOP) R117.1(TOP) R119.2(BOT) R120.2(BOT) ; port TACHOC0
TACHOC1: J9.18 R129.1(TOP) R131.2(BOT) ; port TACHOC1
TACHOD0: J9.23 R116.1(TOP) R118.1(TOP) R121.2(BOT) R122.2(BOT) ; port TACHOD0
TACHOD1: J9.24 R130.1(TOP) R132.2(BOT) ; port TACHOD1
VBAT: F2.1 F3.1
VCC: C39.1 C47.1 R97.2(BOT) R98.2(BOT) R109.1(TOP) R110.1(TOP) R115.2(BOT) R116.2(BOT) R127.1(TOP) R128.1(TOP) U6.1(VCC) U7.1(VCC)  [project net V33]
VCCEXT: J9.4 J9.10 J9.16 J9.22
NetC40_2: C40.2 E1.1 F2.2 U6.4(VSS1) U6.11(VSS2)
NetC48_2: C48.2 E2.1 F3.2 U7.4(VSS1) U7.11(VSS2)

Not connected (* = marked no-connect by the designer): U6 8(VCOUNT); U7 8(VCOUNT)

### Library data of the parts
C39-C54 = CAP: Capacitor
E1 E2 = CAP2: Bi-Polar Capacitor
R97-R132 R171-R174 = RES: Resistor
U6 U7 = LM1836

## Sheet EST_MainV20_Power.SchDoc
size A4
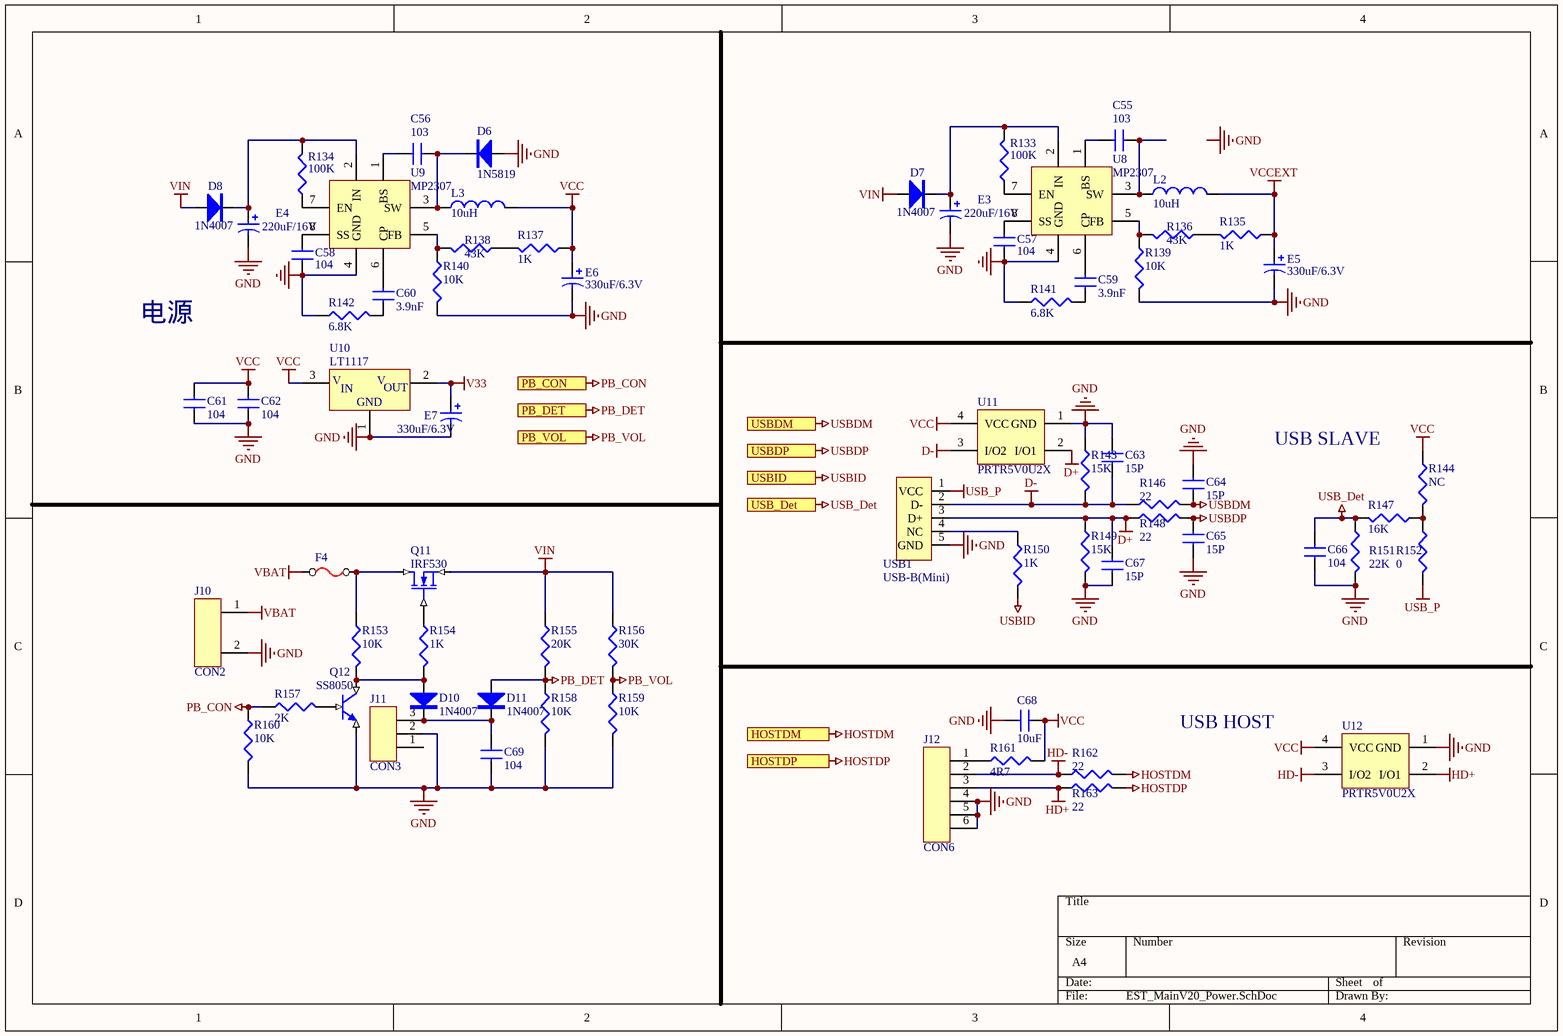
[diagram p3: EST_MainV20_Power.SchDoc]

### Parts
C55  103  [CAP_0603]
C56  103  [CAP_0603]
C57  104  [CAP_0603]
C58  value 104  [CAP_0603]  (hidden comment: 471)
C59  3.9nF  [CAP_0603]
C60  3.9nF  [CAP_0603]
C61  104  [CAP_0603]
C62  104  [CAP_0603]
C63  15P  [CAP_0603]
C64  15P  [CAP_0603]
C65  15P  [CAP_0603]
C66  104  [CAP_0603]
C67  15P  [CAP_0603]
C68  10uF  [CAP_0603]
C69  104  [CAP_0603]
D6  1N5819  [1N4007SMD]
D7  1N4007  [1N4007SMD]
D8  1N4007  [1N4007SMD]
D10  1N4007  [LED-0805]
D11  1N4007  [LED-0805]
E3  value 220uF/16V  [KLF_CD0.254]  (hidden comment: 220uF)
E4  value 220uF/16V  [KLF_CD0.254]  (hidden comment: 220uF)
E5  value 330uF/6.3V  [1812]  (hidden comment: 220uF)
E6  value 330uF/6.3V  [1812]  (hidden comment: 220uF)
E7  value 330uF/6.3V  [1812]  (hidden comment: 220uF)
F4  FUSE  [1812]  (value not drawn)
J10  CON2  [SIP2CON]
J11  CON3  [EST_POW_SW]
J12  CON6  [USB-A]
L2  value 10uH  [L_7x7]  (hidden comment: 220uH)
L3  10uH  [L_7x7]
Q11  IRF530  [8050SMD]
Q12  SS8050  [8050SMD]
R133  value 100K  [RES_0603]  (hidden comment: 0.33)
R134  value 100K  [RES_0603]  (hidden comment: 0.33)
R135  value 1K  [RES_0603]  (hidden comment: 3K)
R136  value 43K  [RES_0603]  (hidden comment: 3K)
R137  value 1K  [RES_0603]  (hidden comment: 3K)
R138  value 43K  [RES_0603]  (hidden comment: 3K)
R139  value 10K  [RES_0603]  (hidden comment: 1K)
R140  value 10K  [RES_0603]  (hidden comment: 1K)
R141  value 6.8K  [RES_0603]  (hidden comment: 1K)
R142  value 6.8K  [RES_0603]  (hidden comment: 1K)
R143  15K  [RES_0603]
R144  NC  [RES_0603]
R146  22  [RES_0603]
R147  16K  [RES_0603]
R148  22  [RES_0603]
R149  15K  [RES_0603]
R150  1K  [RES_0603]
R151  22K  [RES_0603]
R152  0  [RES_0603]
R153  10K  [RES_0603]
R154  1K  [RES_0603]
R155  20K  [RES_0603]
R156  30K  [RES_0603]
R157  2K  [RES_0603]
R158  10K  [RES_0603]
R159  10K  [RES_0603]
R160  10K  [RES_0603]
R161  4R7  [RES_0603]
R162  22  [RES_0603]
R163  22  [RES_0603]
U8  MP2307  [SO-8]
U9  MP2307  [SO-8]
U10  LT1117  [LT1117SMD]
U11  PRTR5V0U2X  [SOT23-4]
U12  PRTR5V0U2X  [SOT23-4]
USB1  USB-B(Mini)  [USB_MINI_5P_DIP]

### Ports
HOSTDM, HOSTDP, PB_CON, PB_DET, PB_VOL, USB_Det, USBDM, USBDP, USBID

### Nets
D+: C67.2 R148.2(BOT) R149.2(BOT) U11.2(I/O1) USB1.3(D+)
D-: C63.1 R143.1(TOP) R146.2(BOT) U11.3(I/O2) USB1.2(D-)
GND: C57.2 C58.2 C61.1 C62.1 C63.2 C64.1 C65.2 C66.1 C67.1 C68.2 C69.1 D6.1(A) E3.2 E4.2 E5.2 E6.2 E7.2 J10.2 J11.2 J12.4 J12.5 J12.6 Q12.1(E) R139.1(TOP) R140.1(TOP) R141.2(BOT) R142.2(BOT) R143.2(BOT) R149.1(TOP) R151.1(TOP) R158.1(TOP) R159.1(TOP) R160.1(TOP) U8.4(GND) U9.4(GND) U10.1(GND) U11.1(GND) U12.1(GND) USB1.5(GND)
HD+: J12.3 R163.2(BOT) U12.2(I/O1)
HD-: J12.2 R162.2(BOT) U12.3(I/O2)
HOSTDM: R162.1(TOP) ; port HOSTDM
HOSTDP: R163.1(TOP) ; port HOSTDP
PB_CON: R157.2(BOT) R160.2(BOT) ; port PB_CON
PB_DET: D11.1(A) R155.1(TOP) R158.2(BOT) ; port PB_DET
PB_VOL: R156.1(TOP) R159.2(BOT) ; port PB_VOL
USB_Det: C66.2 R147.1(TOP) R151.2(BOT) ; port USB_Det
USB_P: R152.1(TOP) USB1.1(VCC)
USBDM: C64.2 R146.1(TOP) ; port USBDM
USBDP: C65.1 R148.1(TOP) ; port USBDP
USBID: R150.1(TOP) ; port USBID
V33: C61.2 C62.2 C68.1 E6.1 E7.1 L3.2 R137.2(BOT) R144.2(BOT) R161.1(TOP) U10.2(VOUT) U10.3(VIN) U11.4(VCC) U12.4(VCC)  [also labelled VCC]
VBAT: F4.2 J10.1
VCCEXT: E5.1 L2.2 R135.2(BOT)
VIN: D7.1(A) D8.1(A) Q11.3(S) R155.2(BOT) R156.2(BOT)
NetC55_1: C55.1 U8.1(BS)
NetC55_2: C55.2 L2.1 U8.3(SW)
NetC56_1: C56.1 U9.1(BS)
NetC56_2: C56.2 D6.2(K) L3.1 U9.3(SW)
NetC57_1: C57.1 U8.8(SS)
NetC58_1: C58.1 U9.8(SS)
NetC59_1: C59.1 U8.6(CP)
NetC59_2: C59.2 R141.1(TOP)
NetC60_1: C60.1 U9.6(CP)
NetC60_2: C60.2 R142.1(TOP)
NetC69_2: C69.2 D10.2(K) D11.2(K) J11.3
NetD7_2: D7.2(K) E3.1 R133.1(TOP) U8.2(IN)
NetD8_2: D8.2(K) E4.1 R134.1(TOP) U9.2(IN)
NetD10_1: D10.1(A) Q12.3(C) R153.1(TOP) R154.1(TOP)
NetF4_1: F4.1 Q11.1(D) R153.2(BOT)
NetJ12_1: J12.1 R161.2(BOT)
NetQ11_2: Q11.2(G) R154.2(BOT)
NetQ12_2: Q12.2(B) R157.1(TOP)
NetR133_2: R133.2(BOT) U8.7(EN)
NetR134_2: R134.2(BOT) U9.7(EN)
NetR135_1: R135.1(TOP) R136.2(BOT)
NetR136_1: R136.1(TOP) R139.2(BOT) U8.5(FB)
NetR137_1: R137.1(TOP) R138.2(BOT)
NetR138_1: R138.1(TOP) R140.2(BOT) U9.5(FB)
NetR144_1: R144.1(TOP) R147.2(BOT) R152.2(BOT)
NetR150_2: R150.2(BOT) USB1.4(NC)

Not connected (* = marked no-connect by the designer): J11 1

### Notes on the sheet
- 电源
- USB SLAVE
- USB HOST
- Labels drawn without touching a wire or pin: GND
- (in symbol LT1117) V; IN; OUT

### Library data of the parts
C55 C56 C58-C69 = CAP: Capacitor
C57 = CAP: Capacitor; Value: 471
D6-D8 D10 D11 = DIODE
E3-E7 = CAP2: Bi-Polar Capacitor
J10 = CON2: SOCKET
J11 = CON3Mini
L2 L3 = INDUCTOR
Q11 = IRF530: N-Channel MOSFET
Q12 = NPN: triode
R133-R144 R146-R163 = RES: Resistor
USB1 = USB5

## Sheet EST_MainV20_Voice.SchDoc
size A4
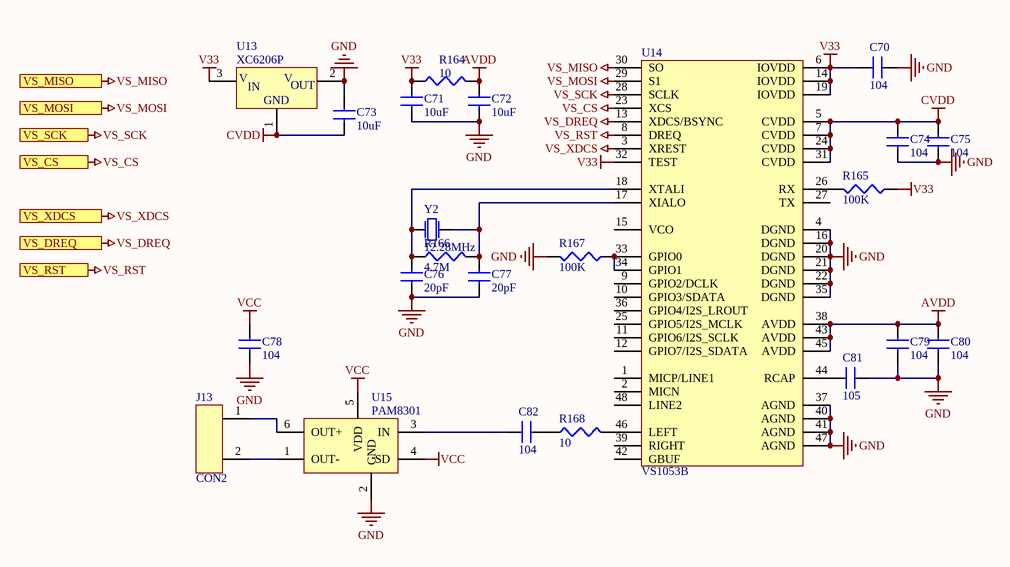
[diagram p4: EST_MainV20_Voice.SchDoc]

### Parts
C70  104  [CAP_0603]
C71  10uF  [CAP_0805]
C72  10uF  [CAP_0805]
C73  10uF  [CAP_0805]
C74  104  [CAP_0603]
C75  104  [CAP_0603]
C76  20pF  [CAP_0603]
C77  20pF  [CAP_0603]
C78  104  [CAP_0603]
C79  104  [CAP_0603]
C80  104  [CAP_0603]
C81  105  [CAP_0603]
C82  104  [CAP_0603]
J13  CON2  [SIP2]
R164  10  [0805]
R165  100K  [RES_0603]
R166  4.7M  [RES_0603]
R167  100K  [RES_0603]
R168  10  [RES_0603]
U13  XC6206P  [8050SMD]
U14  VS1053B  [LQFP48]
U15  PAM8301  [SOT23-6New]
Y2  12.28MHz  [XTAL_5032]

### Ports
VS_CS, VS_DREQ, VS_MISO, VS_MOSI, VS_RST, VS_SCK, VS_XDCS

### Nets
AVDD: C72.2 C79.2 C80.2 R164.1(TOP) U14.38(AVDD) U14.43(AVDD) U14.45(AVDD)
CVDD: C73.1 C74.2 C75.2 U13.1(GND) U14.5(CVDD) U14.7(CVDD) U14.24(CVDD) U14.31(CVDD)
GND: C70.2 C71.1 C72.1 C73.2 C74.1 C75.1 C76.1 C77.1 C78.1 C79.1 C80.1 C81.1 R167.2(BOT) U13.2(VOUT) U14.4(DGND) U14.16(DGND) U14.20(DGND) U14.21(DGND) U14.22(DGND) U14.35(DGND) U14.37(AGND) U14.40(AGND) U14.41(AGND) U14.47(AGND) U15.2(GND)
V33: C70.1 C71.2 C78.2 R164.2(BOT) R165.1(TOP) U13.3(VIN) U14.6(IOVDD) U14.14(IOVDD) U14.19(IOVDD) U14.32(TEST) U15.4(SD) U15.5(VDD)  [also labelled VCC]
VS_CS: U14.23(XCS) ; port VS_CS
VS_DREQ: U14.13(XDCS/BSYNC) ; port VS_DREQ
VS_MISO: U14.30(SO) ; port VS_MISO
VS_MOSI: U14.29(S1) ; port VS_MOSI
VS_RST: U14.8(DREQ) ; port VS_RST
VS_SCK: U14.28(SCLK) ; port VS_SCK
VS_XDCS: U14.3(XREST) ; port VS_XDCS
NetC76_2: C76.2 R166.1(TOP) U14.18(XTALI) Y2.2(P2)
NetC77_2: C77.2 R166.2(BOT) U14.17(XIALO) Y2.1(P1)
NetC81_2: C81.2 U14.44(RCAP)
NetC82_1: C82.1 U15.3(IN)
NetC82_2: C82.2 R168.2(BOT)
NetJ13_1: J13.1 U15.6(OUT+)
NetJ13_2: J13.2 U15.1(OUT-)
NetR165_2: R165.2(BOT) U14.26(RX)
NetR167_1: R167.1(TOP) U14.33(GPIO0) U14.34(GPIO1)
NetR168_1: R168.1(TOP) U14.46(LEFT)

Not connected (* = marked no-connect by the designer): U14 1(MICP/LINE1) 2(MICN) 9(GPIO2/DCLK) 10(GPIO3/SDATA) 11(GPIO6/I2S_SCLK) 12(GPIO7/I2S_SDATA) 15(VCO) 25(GPIO5/I2S_MCLK) 27(TX) 36(GPIO4/I2S_LROUT) 39(RIGHT) 42(GBUF) 48(LINE2)

### Notes on the sheet
- (in symbol XC6206P) V; IN; OUT

### Library data of the parts
C70-C75 C79-C81 = CAP: Capacitor; Value: 20pF
C76-C78 C82 = CAP: Capacitor
  C76 C77: Value: 20pF
J13 = CON2: SOCKET
R164-R168 = RES: Resistor
U14 = VS1053
Y2 = XTAL: CRYSTAL

## Nets that join several sheets
ADC_A0: EST_MainV20 (U1.14), EST_MainV20_Input (R37.2 R45.2)
ADC_A1: EST_MainV20 (U1.15), EST_MainV20_Input (C36.2 R88.2 R94.1)
ADC_B0: EST_MainV20 (U1.27), EST_MainV20_Input (R38.2 R46.2)
ADC_B1: EST_MainV20 (U1.26), EST_MainV20_Input (C37.2 R90.2 R95.1)
ADC_C0: EST_MainV20 (U1.41), EST_MainV20_Input (R39.2 R47.2)
ADC_C1: EST_MainV20 (U1.29), EST_MainV20_Input (C38.2 R92.2 R96.1)
ADC_D0: EST_MainV20 (U1.43), EST_MainV20_Input (R40.2 R48.2)
ADC_D1: EST_MainV20 (U1.42), EST_MainV20_Input (C35.2 R86.2 R93.1)
ADCMA: EST_MainV20 (U1.44), EST_MainV20_Output (C43.2 R101.1 R171.2)
ADCMB: EST_MainV20 (U1.45), EST_MainV20_Output (C44.2 R103.1 R172.2)
ADCMC: EST_MainV20 (U1.46), EST_MainV20_Output (C51.2 R119.1 R173.2)
ADCMD: EST_MainV20 (U1.47), EST_MainV20_Output (C52.2 R121.1 R174.2)
DIGIA0: EST_MainV20 (U1.21), EST_MainV20_Input (C23.1 R69.2)
DIGIA1: EST_MainV20 (U1.19), EST_MainV20_Input (C32.2 R79.1)
DIGIB0: EST_MainV20 (U1.53), EST_MainV20_Input (C25.1 R70.2)
DIGIB1: EST_MainV20 (U1.49), EST_MainV20_Input (C33.2 R81.1)
DIGIC0: EST_MainV20 (U1.57), EST_MainV20_Input (C27.1 R71.2)
DIGIC1: EST_MainV20 (U1.56), EST_MainV20_Input (C34.2 R83.1)
DIGID0: EST_MainV20 (U1.64), EST_MainV20_Input (C29.1 R72.2)
DIGID1: EST_MainV20 (U1.65), EST_MainV20_Input (C31.2 R77.1)
DIRA: EST_MainV20 (U1.132), EST_MainV20_Output (C45.2 R113.1)
DIRB: EST_MainV20 (U1.127), EST_MainV20_Output (C46.2 R114.1)
DIRC: EST_MainV20 (U1.117), EST_MainV20_Output (C53.2 R131.1)
DIRD: EST_MainV20 (U1.115), EST_MainV20_Output (C54.2 R132.1)
GND: EST_MainV20 (42 pins), EST_MainV20_Input (58 pins), EST_MainV20_Output (34 pins), EST_MainV20_Power (39 pins), EST_MainV20_Voice (25 pins)
HOSTDM: EST_MainV20 (U1.75), EST_MainV20_Power (R162.1)
HOSTDP: EST_MainV20 (U1.76), EST_MainV20_Power (R163.1)
I_ONA: EST_MainV20 (U1.18), EST_MainV20_Input (R21.2)
I_ONB: EST_MainV20 (U1.50), EST_MainV20_Input (R22.2)
I_ONC: EST_MainV20 (U1.55), EST_MainV20_Input (R23.2)
I_OND: EST_MainV20 (U1.68), EST_MainV20_Input (R24.2)
INTA0: EST_MainV20 (U1.141), EST_MainV20_Output (C41.2 R99.2)
INTB0: EST_MainV20 (U1.128), EST_MainV20_Output (C42.2 R100.2)
INTC0: EST_MainV20 (U1.123), EST_MainV20_Output (C49.2 R117.2)
INTD0: EST_MainV20 (U1.116), EST_MainV20_Output (C50.2 R118.2)
LEGDETA: EST_MainV20 (U1.20), EST_MainV20_Input (C19.1 R50.2)
LEGDETB: EST_MainV20 (U1.54), EST_MainV20_Input (C20.1 R52.2)
LEGDETC: EST_MainV20 (U1.58), EST_MainV20_Input (C21.1 R54.2)
LEGDETD: EST_MainV20 (U1.63), EST_MainV20_Input (C22.1 R56.2)
MAIN0: EST_MainV20 (U1.125), EST_MainV20_Output (R106.1 U6.6)
MAIN1: EST_MainV20 (U1.126), EST_MainV20_Output (R105.1 U6.2)
MAPWM: EST_MainV20 (U1.140), EST_MainV20_Output (R105.2 R106.2)
MBIN0: EST_MainV20 (U1.118), EST_MainV20_Output (R108.1 U6.9)
MBIN1: EST_MainV20 (U1.119), EST_MainV20_Output (R107.1 U6.13)
MBPWM: EST_MainV20 (U1.139), EST_MainV20_Output (R107.2 R108.2)
MCIN0: EST_MainV20 (U1.92), EST_MainV20_Output (R124.1 U7.6)
MCIN1: EST_MainV20 (U1.93), EST_MainV20_Output (R123.1 U7.2)
MCPWM: EST_MainV20 (U1.82), EST_MainV20_Output (R123.2 R124.2)
MDIN0: EST_MainV20 (U1.91), EST_MainV20_Output (R126.1 U7.9)
MDIN1: EST_MainV20 (U1.90), EST_MainV20_Output (R125.1 U7.13)
MDPWM: EST_MainV20 (U1.81), EST_MainV20_Output (R125.2 R126.2)
PB_CON: EST_MainV20 (U1.1), EST_MainV20_Power (R157.2 R160.2)
PB_DET: EST_MainV20 (U1.142), EST_MainV20_Power (D11.1 R155.1 R158.2)
PB_VOL: EST_MainV20 (U1.13), EST_MainV20_Power (R156.1 R159.2)
RXINA: EST_MainV20 (U1.35), EST_MainV20_Input (R74.2 U4.3)
RXINA_EN: EST_MainV20 (U1.22), EST_MainV20_Input (U4.1 U4.4)
RXINB: EST_MainV20 (U1.37), EST_MainV20_Input (R75.2 U4.8)
RXINB_EN: EST_MainV20 (U1.28), EST_MainV20_Input (U4.10 U4.13)
RXINC: EST_MainV20 (U1.137), EST_MainV20_Input (R76.2 U5.3)
RXINC_EN: EST_MainV20 (U1.59), EST_MainV20_Input (U5.1 U5.4)
RXIND: EST_MainV20 (U1.70), EST_MainV20_Input (R73.2 U5.8)
RXIND_EN: EST_MainV20 (U1.60), EST_MainV20_Input (U5.10 U5.13)
TACHOA0: EST_MainV20 (U1.4), EST_MainV20_Output (5 pins)
TACHOA1: EST_MainV20 (U1.5), EST_MainV20_Output (J9.6 R111.1 R113.2)
TACHOB0: EST_MainV20 (U1.66), EST_MainV20_Output (5 pins)
TACHOB1: EST_MainV20 (U1.67), EST_MainV20_Output (J9.12 R112.1 R114.2)
TACHOC0: EST_MainV20 (U1.97), EST_MainV20_Output (5 pins)
TACHOC1: EST_MainV20 (U1.96), EST_MainV20_Output (J9.18 R129.1 R131.2)
TACHOD0: EST_MainV20 (U1.99), EST_MainV20_Output (5 pins)
TACHOD1: EST_MainV20 (U1.98), EST_MainV20_Output (J9.24 R130.1 R132.2)
TXINA: EST_MainV20 (U1.34), EST_MainV20_Input (U4.5)
TXINB: EST_MainV20 (U1.36), EST_MainV20_Input (U4.12)
TXINC: EST_MainV20 (U1.136), EST_MainV20_Input (U5.5)
TXIND: EST_MainV20 (U1.69), EST_MainV20_Input (U5.12)
USB_Det: EST_MainV20 (U1.101), EST_MainV20_Power (C66.2 R147.1 R151.2)
USBDM: EST_MainV20 (U1.103), EST_MainV20_Power (C64.2 R146.1)
USBDP: EST_MainV20 (U1.104), EST_MainV20_Power (C65.1 R148.1)
USBID: EST_MainV20 (U1.102), EST_MainV20_Power (R150.1)
V33: EST_MainV20 (36 pins), EST_MainV20_Input (26 pins), EST_MainV20_Output (12 pins), EST_MainV20_Power (13 pins), EST_MainV20_Voice (12 pins)
VBAT: EST_MainV20_Input (F1.1), EST_MainV20_Output (F2.1 F3.1), EST_MainV20_Power (F4.2 J10.1)
VCCEXT: EST_MainV20_Input (J5.4 J6.4 J7.4 J8.4), EST_MainV20_Output (J9.4 J9.10 J9.16 J9.22), EST_MainV20_Power (E5.1 L2.2 R135.2)
VS_CS: EST_MainV20 (U1.40), EST_MainV20_Voice (U14.23)
VS_DREQ: EST_MainV20 (U1.89), EST_MainV20_Voice (U14.13)
VS_MISO: EST_MainV20 (U1.112), EST_MainV20_Voice (U14.30)
VS_MOSI: EST_MainV20 (U1.113), EST_MainV20_Voice (U14.29)
VS_RST: EST_MainV20 (U1.100), EST_MainV20_Voice (U14.8)
VS_SCK: EST_MainV20 (U1.111), EST_MainV20_Voice (U14.28)
VS_XDCS: EST_MainV20 (U1.86), EST_MainV20_Voice (U14.3)